# Altium schematic sheet Clock.schdoc
size 297 x 210 mm; Symbol: Sheet-Symbol_A4; Company: 嘉立创EDA; Version: V1.0; Page Size: A4; @Project Name: prj_extend_and_core_board_7_8; @Page Count: 7; @Update Date: 2024-08-11; @Create Date: 2024-08-09; @Schematic Name: Schematic1; @Page No: 2; @Page Name: Clock; Device: Sheet-Symbol_A4
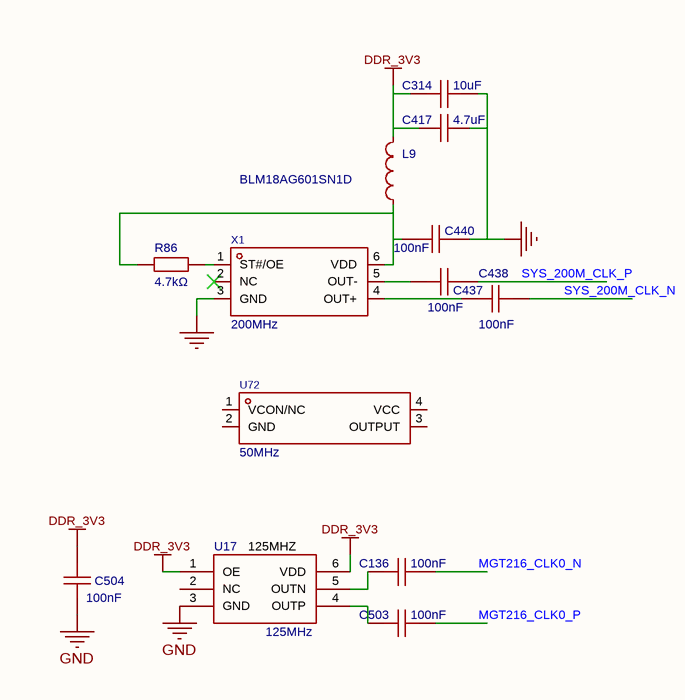
[diagram p0: Clock.schdoc]

## Parts
C136  100nF  [C0402]
C314  10uF  [C0603]
C417  4.7uF  [C0603]
C437  100nF  [C0402]
C438  100nF  [C0402]
C440  100nF  [C0402]
C503  100nF  [C0402]
C504  100nF  [C0402]
L9  BLM18AG601SN1D  [L0603]
R86  4.7kΩ  [R0603]
U17  125MHz  [OSC-SMD_6P-L5.0-W3.2-P1.27-BL]
U72  50MHz  [OSC-SMD_4P-L7.0-W5.0-BL]
X1  200MHz  [OSC-SMD_6P-L7.0-W5.0-BL]

## Nets
DDR_3V3: C314.2 C417.1 C504.1 L9.2 U17.1(OE) U17.6(VDD)
GND: C314.1 C417.2 C440.2 C504.2 U17.3(GND) X1.3(GND)
MGT216_CLK0_N: C136.1
MGT216_CLK0_P: C503.1
SYS_200M_CLK_N: C438.2
SYS_200M_CLK_P: C437.2
NetC136_2: C136.2 U17.5(OUTN)
NetC437_1: C437.1 X1.5(OUT-)
NetC438_1: C438.1 X1.4(OUT+)
NetC440_1: C440.1 L9.1 R86.2 X1.6(VDD)
NetC503_2: C503.2 U17.4(OUTP)
NetR86_1: R86.1 X1.1(ST#/OE)

Not connected (* = marked no-connect by the designer): U17 2(NC); U72 1(VCON/NC) 2(GND) 3(OUTPUT) 4(VCC); X1 2(NC)*

## Notes on the sheet
- (near U17) 125MHZ
- 1
- 2
- 3
- 4
- 5
- 6
- A
- B
- C
- 更新日期
- 2024-08-11
- 原理图
- 图页
- Schematic1
- Clock
- 创建日期
- 物料编码
- 2024-08-09
- D
- 审阅
- 绘制
- prj_extend_and_core_board_7_8
- 版本
- V1.0
- 尺寸
- A4
- 页
- 嘉立创EDA
- 共
- 7

## Library data of the parts
C136 C503 C504 = 0402B104K500NT: 容值:100nF;精度:±10%;额定电压:50V;材质(温度系数):X7R;; Manufacturer: FH(风华); Symbol: CapAcitance; AddInBom: yes; ModelId: 36a51122f27c49738f86b3bfa98863e0; ModelName: C0402_L1.0-W0.5-H0.5; ModelTransform: 39.37,19.685,0,0,0,0,0,0,0; Tolerance: ±10%; Voltage Rated: 50V; Temperature Coefficient: X7R; Device: 0402B104K500NT; LCSC Part Name: 100nF ±10% 50V; SupplierPart: C110251; ManufacturerPart: 0402B104K500NT; Supplier Footprint: 0402; JLCPCB Part Class: Extended Part; Datasheet: https://atta.szlcsc.com/upload/public/pdf/source/20200305/C486355_26A10D38EF8C2A5C37091D0039909270.pdf; Supplier: LCSC; ConvertToPcb: yes; FootprintName: C0402; Value: 100nF
C314 = CL10A106KP8NNNC: 容值:10uF;精度:±10%;额定电压:10V;材质(温度系数):X5R;; Manufacturer: SAMSUNG(三星); AddInBom: yes; ModelId: ac125912035d415993ca9572d50418b1; ModelName: C0603_L1.6-W0.8-H0.8; ModelTransform: 62.992,31.496,0,0,0,0,0,0,0; Tolerance: ±10%; Voltage Rated: 10V; Temperature Coefficient: X5R; Symbol: CL10A106KP8NNNC; Device: CL10A106KP8NNNC; Supplier: LCSC; Manufacturer Part: CL10A106KP8NNNC; Value: 10uF; Supplier Part: C19702; JLCPCB Part Class: 基础库; LCSC Part Name: 10uF ±10% 10V; Supplier Footprint: 0603; Datasheet: https://atta.szlcsc.com/upload/public/pdf/source/20160218/1457707763339.pdf; ConvertToPcb: yes; FootprintName: C0603
C417 = CL10A475KO8NNNC: 容值:4.7uF;精度:±10%;额定电压:16V;材质(温度系数):X5R;; Manufacturer: SAMSUNG(三星); AddInBom: yes; ModelId: ac125912035d415993ca9572d50418b1; ModelName: C0603_L1.6-W0.8-H0.8; ModelTransform: 62.992,31.496,0,0,0,0,0,0,0; Tolerance: ±10%; Voltage Rated: 16V; Temperature Coefficient: X5R; Symbol: CL10A475KO8NNNC; Device: CL10A475KO8NNNC; Supplier: LCSC; Manufacturer Part: CL10A475KO8NNNC; Value: 4.7uF; Supplier Part: C19666; JLCPCB Part Class: 基础库; LCSC Part Name: 4.7uF ±10% 16V; Supplier Footprint: 0603; Datasheet: https://atta.szlcsc.com/upload/public/pdf/source/20160218/1457707763339.pdf; ConvertToPcb: yes; FootprintName: C0603
C437 C438 C440 = GRM155R71H104KE14D: 容值:100nF;精度:±10%;额定电压:50V;材质(温度系数):X7R;; Manufacturer: muRata(村田); AddInBom: yes; ModelId: 36a51122f27c49738f86b3bfa98863e0; ModelName: C0402_L1.0-W0.5-H0.5; ModelTransform: 39.37,19.685,0,0,0,0,0,0,0; Tolerance: ±10%; Voltage Rated: 50V; Temperature Coefficient: X7R; Symbol: GRM155R71H104KE14D; Device: GRM155R71H104KE14D; Supplier: LCSC; Manufacturer Part: GRM155R71H104KE14D; Value: 100nF; Supplier Part: C77020; JLCPCB Part Class: 扩展库; LCSC Part Name: 100nF ±10% 50V; Supplier Footprint: 0402; Datasheet: https://atta.szlcsc.com/upload/public/pdf/source/20180326/C77020_39BD49C951FF1AF0DB1F1FAC5AC1E401.pdf; ConvertToPcb: yes; FootprintName: C0402
L9 = BLM18AG601SN1D: 标称阻抗@测试频率:600Ω@100MHz;误差:±25%;直流电阻(RDC):380mΩ;; Manufacturer: muRata(村田); AddInBom: yes; ModelId: 2bc5ec593d464d6ba9807aec0b5673c2; ModelName: L0603_L1.6-W0.8-H0.5_BEAD; ModelTransform: 62.992,31.496,0,180,0,0,0.094,0.629,0; Tolerance: ±25%; DC Resistance: 380mΩ; Current Rating: 500mA; Circuits: 1; Symbol: BLM18AG601SN1D; Device: BLM18AG601SN1D; LCSC Part Name: 单路 0603磁珠 阻抗600Ω@100MHz; SupplierPart: C19330; ManufacturerPart: BLM18AG601SN1D; Supplier Footprint: 0603; JLCPCB Part Class: 扩展库; Datasheet: https://atta.szlcsc.com/upload/public/pdf/source/20180329/C160981_FD3C2D2622A377E203B89F4AA32B0741.pdf; Supplier: LCSC; ConvertToPcb: yes; FootprintName: L0603; Impedance @ Frequency: 600Ω@100MHz
R86 = 0603WAF4701T5E: 电阻类型:厚膜电阻;阻值:4.7kΩ;精度:±1%;功率:100mW;最大工作电压:75V;温度系数:±100ppm/℃;; Manufacturer: UNI-ROYAL(厚声); AddInBom: yes; ModelId: fc143cca1e79419f9cd78b61e9279f08; ModelTransform: 31.8897,63.7794,0,90,0,0,0,0,0; Tolerance: ±1%; Power(Watts): 100mW; Overload Voltage (Max): 75V; Symbol: 0603WAF4701T5E; Device: 0603WAF4701T5E; Supplier: LCSC; Manufacturer Part: 0603WAF4701T5E; Supplier Part: C23162; Value: 4.7kΩ; JLCPCB Part Class: 基础库; LCSC Part Name: 4.7kΩ ±1% 100mW 厚膜电阻; Supplier Footprint: 0603; Datasheet: https://atta.szlcsc.com/upload/public/pdf/source/20200306/C422600_1E6D84923E4A46A82E41ADD87F860B5C.pdf; ConvertToPcb: yes; FootprintName: R0603; ModelName: R0603; Type: 厚膜电阻; Temperature Coefficient: ±100ppm/℃; Operating Temperature Range: -55℃~+155℃
U17 = SiT9120AI-2C1-33E125.000000: 频率:125MHz;频率稳定度(全温):±20ppm;输出模式:LVDS;供电电压:3.3V;; Manufacturer: SITIME; AddInBom: yes; ModelId: 72a3231e93d64dfc818acb310ea865be; ModelTransform: 196.85,125.984,0,0,0,0,0,0,0; Frequency Stability(Full temperature range): ±20ppm; Output Type: LVDS; Supply Voltage: 3.3V; Supply Current(Max): 55mA; Symbol: SiT9120AI-2C1-33E125.000; Device: SiT9120AI-2C1-33E125.000000; LCSC Part Name: 125MHz ±20ppm LVDS 3.3V; SupplierPart: C5362954; ManufacturerPart: SiT9120AI-2C1-33E125.000000; Supplier Footprint: SMD5032-6P; JLCPCB Part Class: Extended Part; Datasheet: https://atta.szlcsc.com/upload/public/pdf/source/20210606/46F3AEA654DB1EB21FABD86504996C92.pdf; Supplier: LCSC; ConvertToPcb: yes; FootprintName: OSC-SMD_6P-L5.0-W3.2-P1.27-BL; ModelName: OSC-SMD_6P-L5.0-W3.2-P1.27-BL; Value: 125MHz; Operating Temperature: -40℃~+85℃
U72 = NT0507BH3I106BA50: 频率:50MHz;频率稳定度(全温):±1ppm;输出模式:方波;工作电压:3.3V;; Manufacturer: XTALTQ(恒晶科技); AddInBom: yes; ModelId: 2fc04ec2295f4b92bdb5570bebe319d8; ModelName: OSC-SMD_4P-L7.0-W5.0-H1.3; ModelTransform: 275.59,196.85,0,0,0,0,0,0,0; Frequency Stability(Full temperature range): ±1ppm; Output Type: 方波; Supply Voltage: 3.3V; Supply Current (Max): 12mA; Symbol: NT0507BH3I106BA50; Device: NT0507BH3I106BA50; Supplier: LCSC; Supplier Part: C5375377; Manufacturer Part: NT0507BH3I106BA50; link: https://atta.szlcsc.com/upload/public/pdf/source/20230316/244B1982FC1B532980637933EC076B7D.pdf; LCSC Part Name: 50MHz 3.3V ±1ppm; Supplier Footprint: SMD7050-6P; Datasheet: https://atta.szlcsc.com/upload/public/pdf/source/20230316/244B1982FC1B532980637933EC076B7D.pdf; ConvertToPcb: yes; FootprintName: OSC-SMD_4P-L7.0-W5.0-BL; Value: 50MHz; Operating Temperature: -40℃~+85℃
X1 = SiT9102AI-282N33E200: 频率:200MHz;频率稳定度(全温):±25ppm;输出模式:LVDS;供电电压:3.3V;; Manufacturer: SITIME; AddInBom: yes; ModelId: 23129cf5a7114f778f1b7eb188929918; ModelName: OSC-SMD_6P-L7.0-W5.0-H1.3-BL; ModelTransform: 275.59,196.85,0,0,0,0,0,0,0; Frequency Stability(Full temperature range): ±25ppm; Output Type: LVDS; Supply Voltage: 3.3V; Symbol: SIT9102AI-282N33E200; Device: SiT9102AI-282N33E200; Supplier: LCSC; Supplier Part: C787765; Manufacturer Part: SiT9102AI-282N33E200; Frequency: 200MHz; JLCPCB Part Class: 扩展库; LCSC Part Name: 200MHz ±25ppm 3.3V LVDS; Supplier Footprint: SMD7050-6P; Datasheet: https://atta.szlcsc.com/upload/public/pdf/source/20190702/C401170_FAD5E70C901EC4CAA5B2331F4BCE9FD4.pdf; ConvertToPcb: yes; FootprintName: OSC-SMD_6P-L7.0-W5.0-BL; Value: 200MHz; Operating Temperature: -40℃~+85℃